# EAGLE design piezopiano (EAGLE 9.5.2)
CHECKED_BY: -; DRAWN_BY: Andreas Zapfl; REV: 1.1; TITLE: PiezoPiano
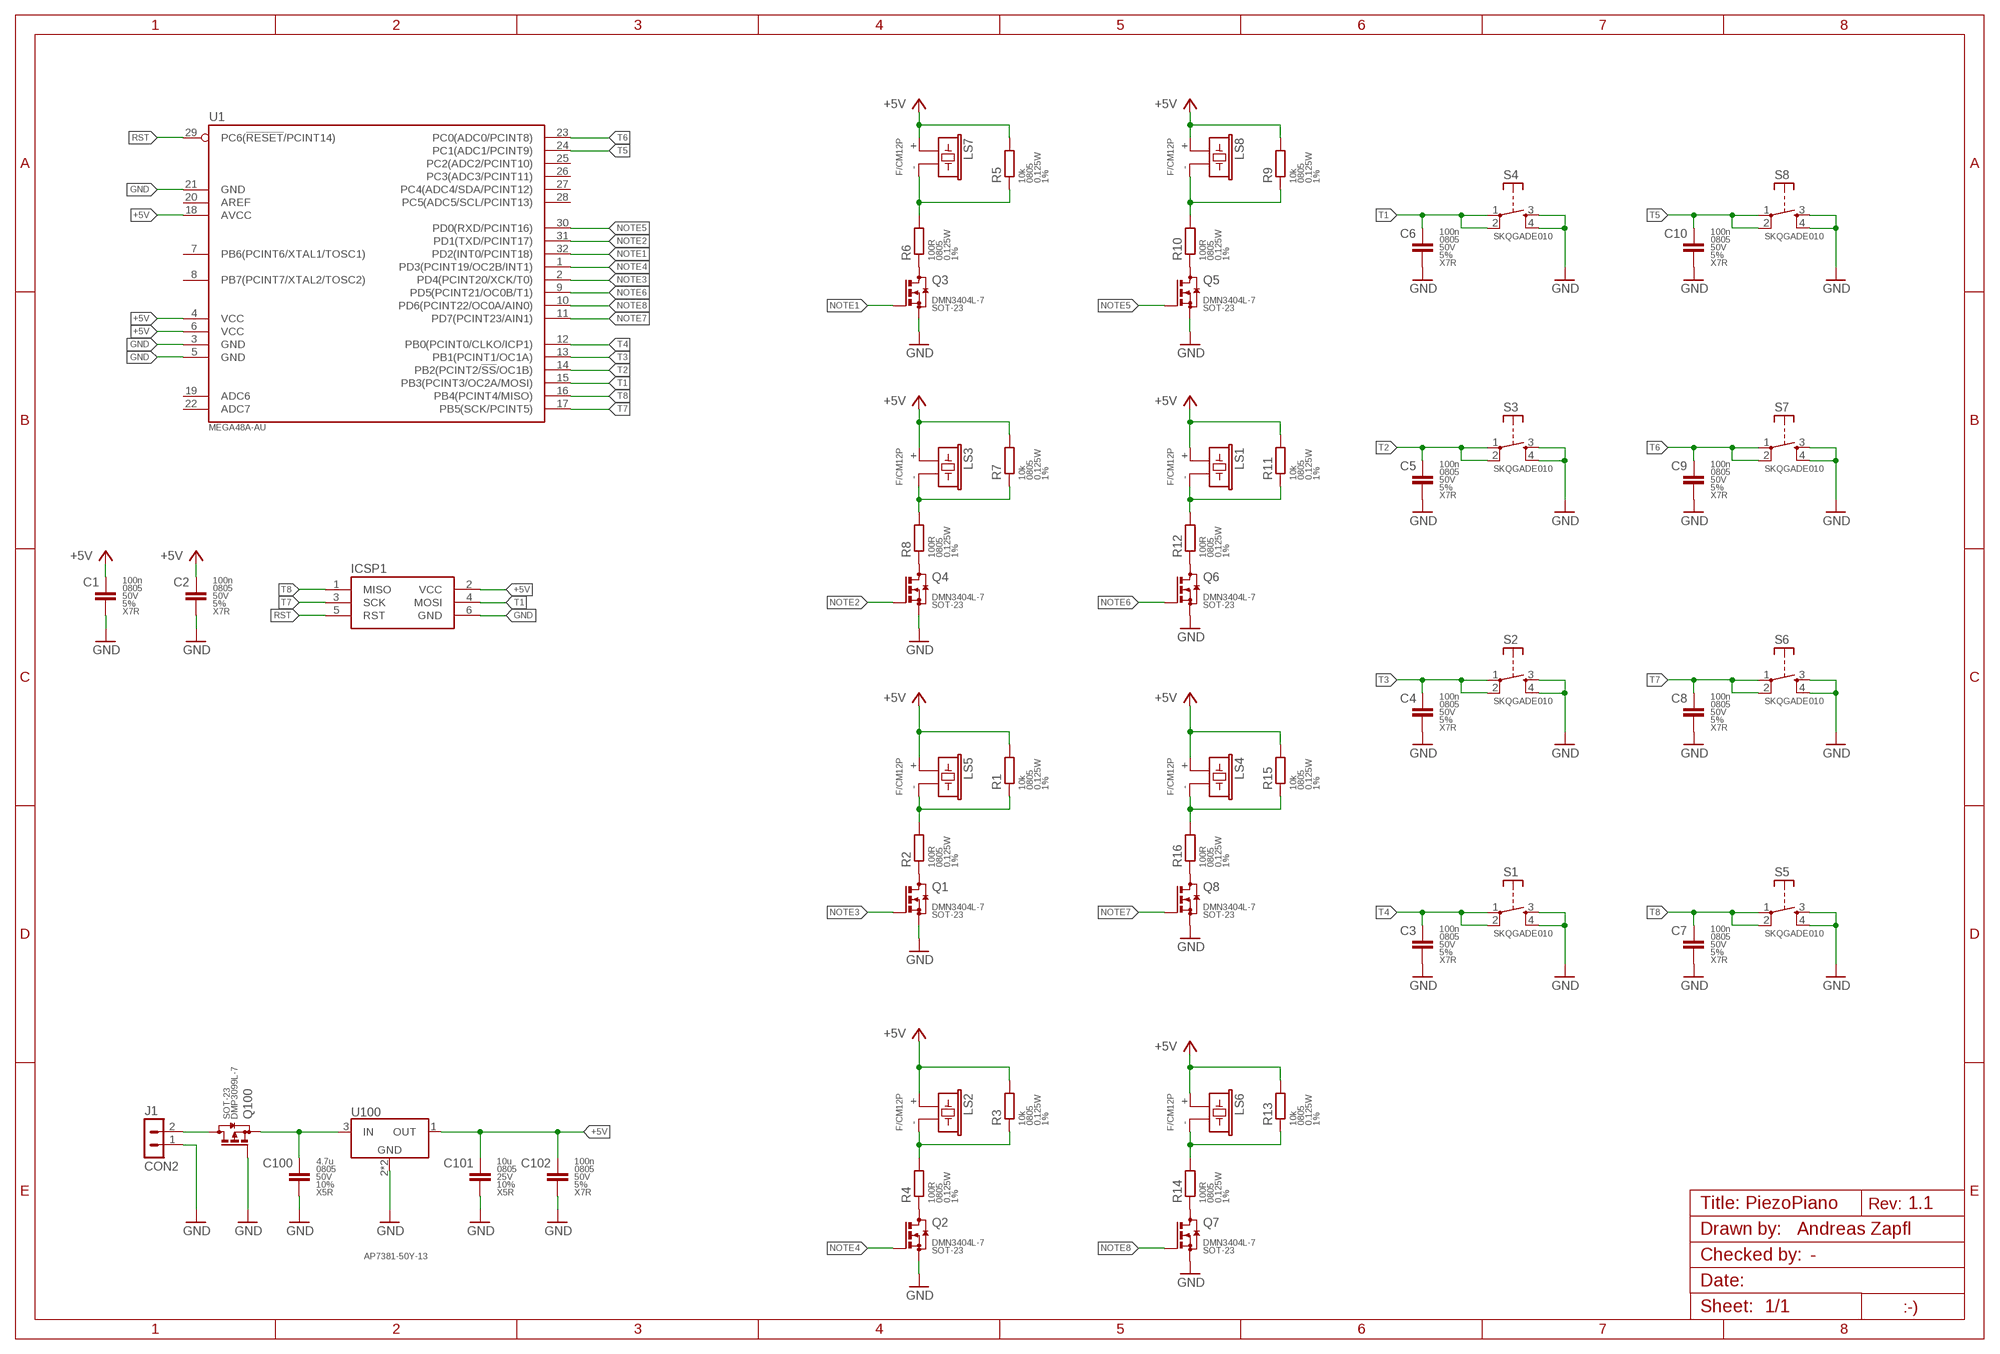
[diagram p0: schematic, sheet 1]

## Parts
C1  100n  100NF-0805-50V-5%  [C0805]
C2  100n  100NF-0805-50V-5%  [C0805]
C3  100n  100NF-0805-50V-5%  [C0805]
C4  100n  100NF-0805-50V-5%  [C0805]
C5  100n  100NF-0805-50V-5%  [C0805]
C6  100n  100NF-0805-50V-5%  [C0805]
C7  100n  100NF-0805-50V-5%  [C0805]
C8  100n  100NF-0805-50V-5%  [C0805]
C9  100n  100NF-0805-50V-5%  [C0805]
C10  100n  100NF-0805-50V-5%  [C0805]
C100  4.7u  4.7UF-0805-50V-10%  [C0805]
C101  10u  10UF-0805-25V-10%  [C0805]
C102  100n  100NF-0805-50V-5%  [C0805]
ICSP1  AVRISP2.54MM  [AVRISP-2.54]
J1  CON2  [H2-2.54]
LS1  F/CM12P  [CM12P/5.0P]
LS2  F/CM12P  [CM12P/5.0P]
LS3  F/CM12P  [CM12P/5.0P]
LS4  F/CM12P  [CM12P/5.0P]
LS5  F/CM12P  [CM12P/5.0P]
LS6  F/CM12P  [CM12P/5.0P]
LS7  F/CM12P  [CM12P/5.0P]
LS8  F/CM12P  [CM12P/5.0P]
Q1  DMN3404L  [SOT23]
Q2  DMN3404L  [SOT23]
Q3  DMN3404L  [SOT23]
Q4  DMN3404L  [SOT23]
Q5  DMN3404L  [SOT23]
Q6  DMN3404L  [SOT23]
Q7  DMN3404L  [SOT23]
Q8  DMN3404L  [SOT23]
Q100  DMP3099L  [SOT23]
R1  10k  10KOHM-0805-1/8W-1%  [R0805]
R2  100R  100OHM-0805-1/8W-1%  [R0805]
R3  10k  10KOHM-0805-1/8W-1%  [R0805]
R4  100R  100OHM-0805-1/8W-1%  [R0805]
R5  10k  10KOHM-0805-1/8W-1%  [R0805]
R6  100R  100OHM-0805-1/8W-1%  [R0805]
R7  10k  10KOHM-0805-1/8W-1%  [R0805]
R8  100R  100OHM-0805-1/8W-1%  [R0805]
R9  10k  10KOHM-0805-1/8W-1%  [R0805]
R10  100R  100OHM-0805-1/8W-1%  [R0805]
R11  10k  10KOHM-0805-1/8W-1%  [R0805]
R12  100R  100OHM-0805-1/8W-1%  [R0805]
R13  10k  10KOHM-0805-1/8W-1%  [R0805]
R14  100R  100OHM-0805-1/8W-1%  [R0805]
R15  10k  10KOHM-0805-1/8W-1%  [R0805]
R16  100R  100OHM-0805-1/8W-1%  [R0805]
S1  SKQGADE010  [TACTILE_SWITCH_SMD_5.2MM]
S2  SKQGADE010  [TACTILE_SWITCH_SMD_5.2MM]
S3  SKQGADE010  [TACTILE_SWITCH_SMD_5.2MM]
S4  SKQGADE010  [TACTILE_SWITCH_SMD_5.2MM]
S5  SKQGADE010  [TACTILE_SWITCH_SMD_5.2MM]
S6  SKQGADE010  [TACTILE_SWITCH_SMD_5.2MM]
S7  SKQGADE010  [TACTILE_SWITCH_SMD_5.2MM]
S8  SKQGADE010  [TACTILE_SWITCH_SMD_5.2MM]
U1  MEGA48A-AU  [TQFP32-08]
U100  AP7381-50Y-13  [SOT89]

## Nets
+5V: C1.1 C2.1 C101.1 C102.1 ICSP1.2(VCC) LS1.+ LS2.+ LS3.+ LS4.+ LS5.+ LS6.+ LS7.+ LS8.+ R1.2 R3.2 R5.2 R7.2 R9.2 R11.2 R13.2 R15.2 U1.4(VCC) U1.6(VCC) U1.18(AVCC) U100.1(OUT)
GND: C1.2 C2.2 C3.2 C4.2 C5.2 C6.2 C7.2 C8.2 C9.2 C10.2 C100.2 C101.2 C102.2 ICSP1.6(GND) J1.1 Q1.2(S) Q2.2(S) Q3.2(S) Q4.2(S) Q5.2(S) Q6.2(S) Q7.2(S) Q8.2(S) Q100.1(G) S1.3(S) S1.4(S) S2.3(S) S2.4(S) S3.3(S) S3.4(S) S4.3(S) S4.4(S) S5.3(S) S5.4(S) S6.3(S) S6.4(S) S7.3(S) S7.4(S) S8.3(S) S8.4(S) U1.3(GND) U1.5(GND) U1.21(GND) U100.2(GND) U100.2@1(GND)
N$1: J1.2 Q100.3(D)
N$2: Q4.3(D) R8.1
N$3: Q1.3(D) R2.1
N$4: LS2.- R3.1 R4.2
N$5: Q5.3(D) R10.1
N$6: LS1.- R11.1 R12.2
N$7: Q8.3(D) R16.1
N$8: Q7.3(D) R14.1
N$9: Q3.3(D) R6.1
N$10: LS3.- R7.1 R8.2
N$11: LS5.- R1.1 R2.2
N$12: Q2.3(D) R4.1
N$13: LS8.- R9.1 R10.2
N$14: Q6.3(D) R12.1
N$15: LS4.- R15.1 R16.2
N$16: LS6.- R13.1 R14.2
N$17: C100.1 Q100.2(S) U100.3(IN)
N$18: LS7.- R5.1 R6.2
NOTE1: Q3.1(G) U1.32(PD2(INT0/PCINT18))
NOTE2: Q4.1(G) U1.31(PD1(TXD/PCINT17))
NOTE3: Q1.1(G) U1.2(PD4(PCINT20/XCK/T0))
NOTE4: Q2.1(G) U1.1(PD3(PCINT19/OC2B/INT1))
NOTE5: Q5.1(G) U1.30(PD0(RXD/PCINT16))
NOTE6: Q6.1(G) U1.9(PD5(PCINT21/OC0B/T1))
NOTE7: Q8.1(G) U1.11(PD7(PCINT23/AIN1))
NOTE8: Q7.1(G) U1.10(PD6(PCINT22/OC0A/AIN0))
RST: ICSP1.5(RST) U1.29(PC6(!RESET!/PCINT14))
T1: C6.1 ICSP1.4(MOSI) S4.1(P) S4.2(P) U1.15(PB3(PCINT3/OC2A/MOSI))
T2: C5.1 S3.1(P) S3.2(P) U1.14(PB2(PCINT2/!SS!/OC1B))
T3: C4.1 S2.1(P) S2.2(P) U1.13(PB1(PCINT1/OC1A))
T4: C3.1 S1.1(P) S1.2(P) U1.12(PB0(PCINT0/CLKO/ICP1))
T5: C10.1 S8.1(P) S8.2(P) U1.24(PC1(ADC1/PCINT9))
T6: C9.1 S7.1(P) S7.2(P) U1.23(PC0(ADC0/PCINT8))
T7: C8.1 ICSP1.3(SCK) S6.1(P) S6.2(P) U1.17(PB5(SCK/PCINT5))
T8: C7.1 ICSP1.1(MISO) S5.1(P) S5.2(P) U1.16(PB4(PCINT4/MISO))
Unconnected: U1.7(PB6(PCINT6/XTAL1/TOSC1)) U1.8(PB7(PCINT7/XTAL2/TOSC2)) U1.19(ADC6) U1.20(AREF) U1.22(ADC7) U1.25(PC2(ADC2/PCINT10)) U1.26(PC3(ADC3/PCINT11)) U1.27(PC4(ADC4/SDA/PCINT12)) U1.28(PC5(ADC5/SCL/PCINT13))

## Library data of the parts
C1-C10 C102 = zaan-Capacitors:100NF: 100nF capacitor; DESCRIPTION: Surface Mount Capacitor; DIELECTRIC: X7R; MF: Yageo; MPN: CC0805JRX7R9BB104; PACKAGE: 2012; PACKAGE-IN: 0805; TOLERANCE: 5%; VOLTAGE: 50V
C100 = zaan-Capacitors:4.7UF: 4.7uF capacitor; DESCRIPTION: Surface Mount Capacitor; DIELECTRIC: X5R; MF: Murata; MPN: GRM21BR61H475KE51L; PACKAGE: 2012; PACKAGE-IN: 0805; TOLERANCE: 10%; VOLTAGE: 50V
C101 = zaan-Capacitors:10UF: 10uF capacitor; DESCRIPTION: Surface Mount Capacitor; DIELECTRIC: X5R; MF: Murata; MPN: GRJ21BR61E106KE01K; PACKAGE: 2012; PACKAGE-IN: 0805; TOLERANCE: 10%; VOLTAGE: 25V
ICSP1 = Custom:AVRISP
J1 = Custom:CON2
LS1-LS8 = zaan-Electromechanical:F/CM12P: BUZZER; DESCRIPTION: Piezo Buzzer; MF: ZLFY; MPN: ZL-YDW1207-4005PA-5.0
Q1-Q8 = zaan-Discrete:DMN3404L: N-CHANNEL MOS FET N-Channel Logic Level Enhancement Mode Field Effect Transistor Footprint: SOT-23 Source: Datasheet <https://www.diodes.com/assets/Datasheets/ds31787.pdf> Manufacturer: Diodes Incorporated; DESCRIPTION: N-CHANNEL MOSFET; MF: Diodes Incorporated; MPN: DMN3404L-7; PACKAGE: SOT-23
Q100 = zaan-Discrete:DMP3099L: P-CHANNEL MOS FET P-Channel Logic Level Enhancement Mode Field Effect Transistor Footprint: SOT-23 Source: Datasheet <https://www.diodes.com/assets/Datasheets/DMP3099L.pdf> Manufacturer: Diodes Incorporated; DESCRIPTION: P-CHANNEL MOSFET; MF: Diodes Incorporated; MPN: DMP3099L-7; PACKAGE: SOT-23
R1 R3 R5 R7 R9 R11 R13 R15 = zaan-Resistors:10KOHM: 10kΩ resistor; DESCRIPTION: Surface Mount Resistor; MF: Yageo; MPN: RC0805FR-0710KL; PACKAGE: 2012; PACKAGE-IN: 0805; POWER: 0.125W; TOLERANCE: 1%; VOLTAGE: 150V
R2 R4 R6 R8 R10 R12 R14 R16 = zaan-Resistors:100OHM: 100Ω resistor; DESCRIPTION: Surface Mount Resistor; MF: Yageo; MPN: RC0805FR-07100RL; PACKAGE: 2012; PACKAGE-IN: 0805; POWER: 0.125W; TOLERANCE: 1%; VOLTAGE: 150V
S1-S8 = zaan-Electromechanical:SKQGADE010
U1 = zaan-IC-Microcontroller:MEGA48: 8-Bit Microcontroller megaAVR® low power, CMOS 8-bit microcontroller Footprint: TQFP-32 Source: Datasheet <http://ww1.microchip.com/downloads/en/DeviceDoc/ATmega48A-PA-88A-PA-168A-PA-328-P-DS-DS40002061A.pdf> Manufacturer: Atmel; DESCRIPTION: 8-Bit Microcontroller; MF: Atmel; MPN: ATmega48A-AU; PACKAGE: TQFP-32
U100 = zaan-IC-Power:AP7381: Low Dropout Regulator WIDE INPUT VOLTAGE RANGE, 150mA ULDO REGULATOR Footprint: SOT-89 Source: Datasheet <https://www.diodes.com/assets/Datasheets/AP7381.pdf> Manufacturer: Diodes Incorporated; DESCRIPTION: Low Dropout Regulator; MF: Diodes Incorporated; MPN: AP7381-50Y-13; PACKAGE: SOT-89

## Net classes
0 default: width 0.254 mm

## Board
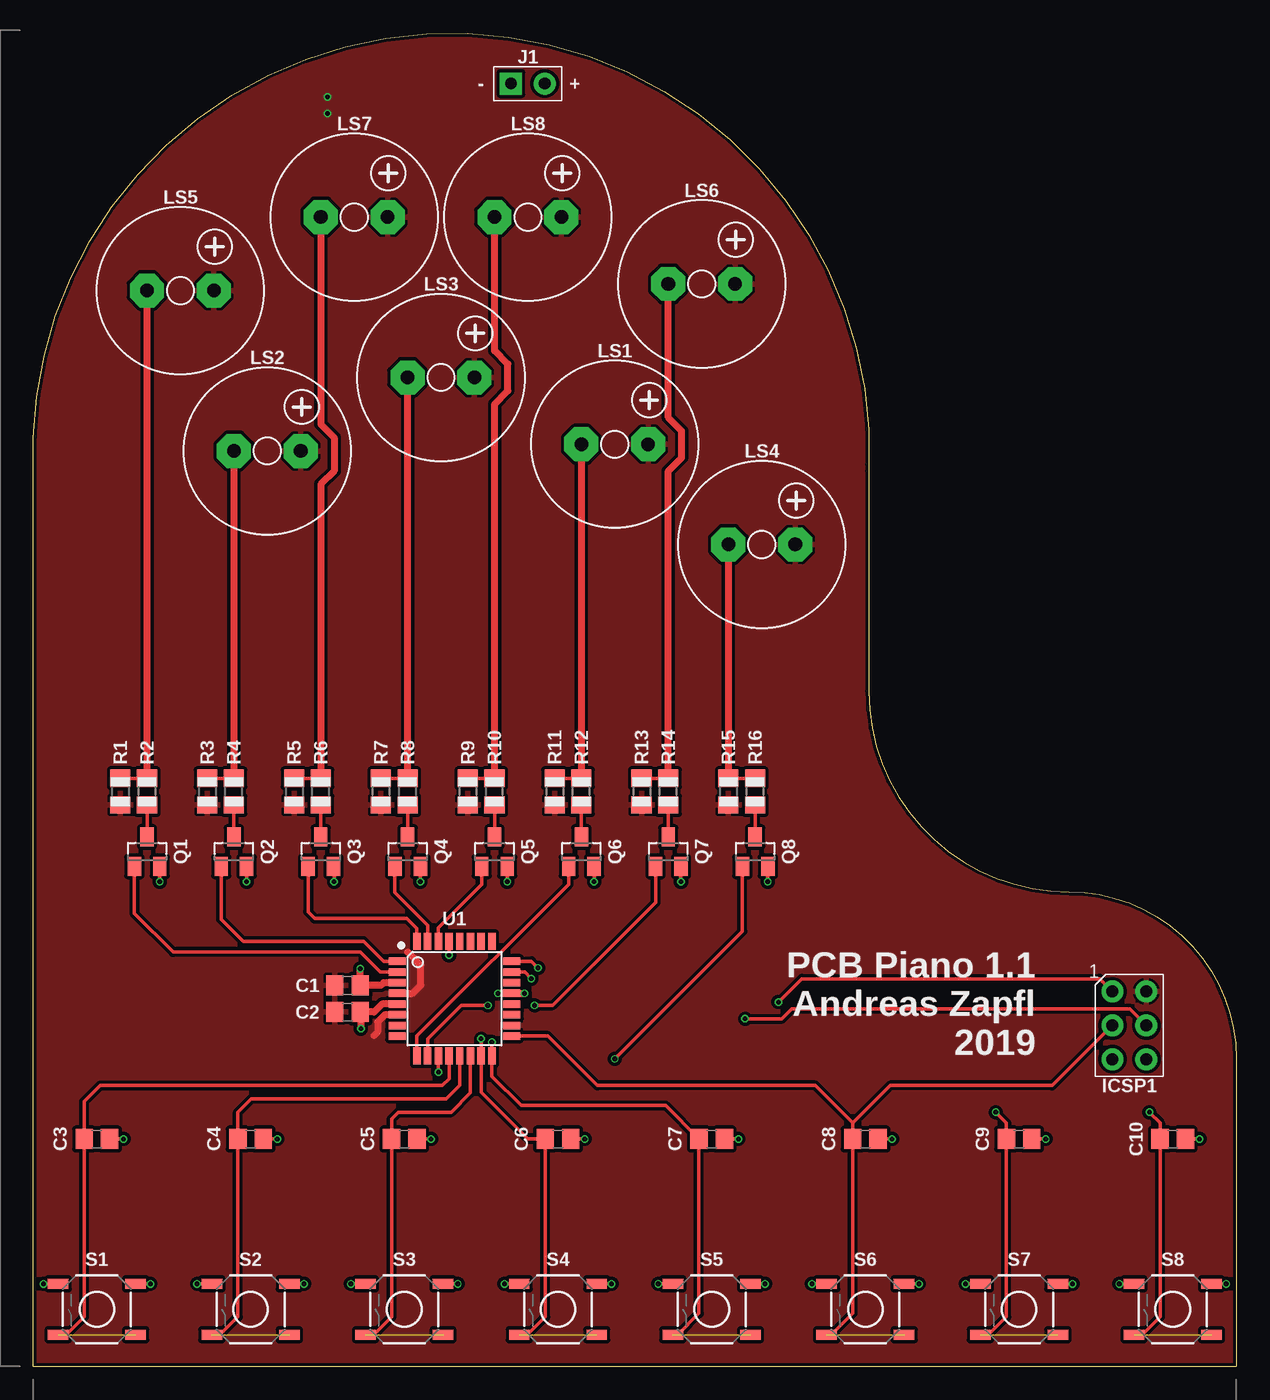
[diagram p1: board, top side]
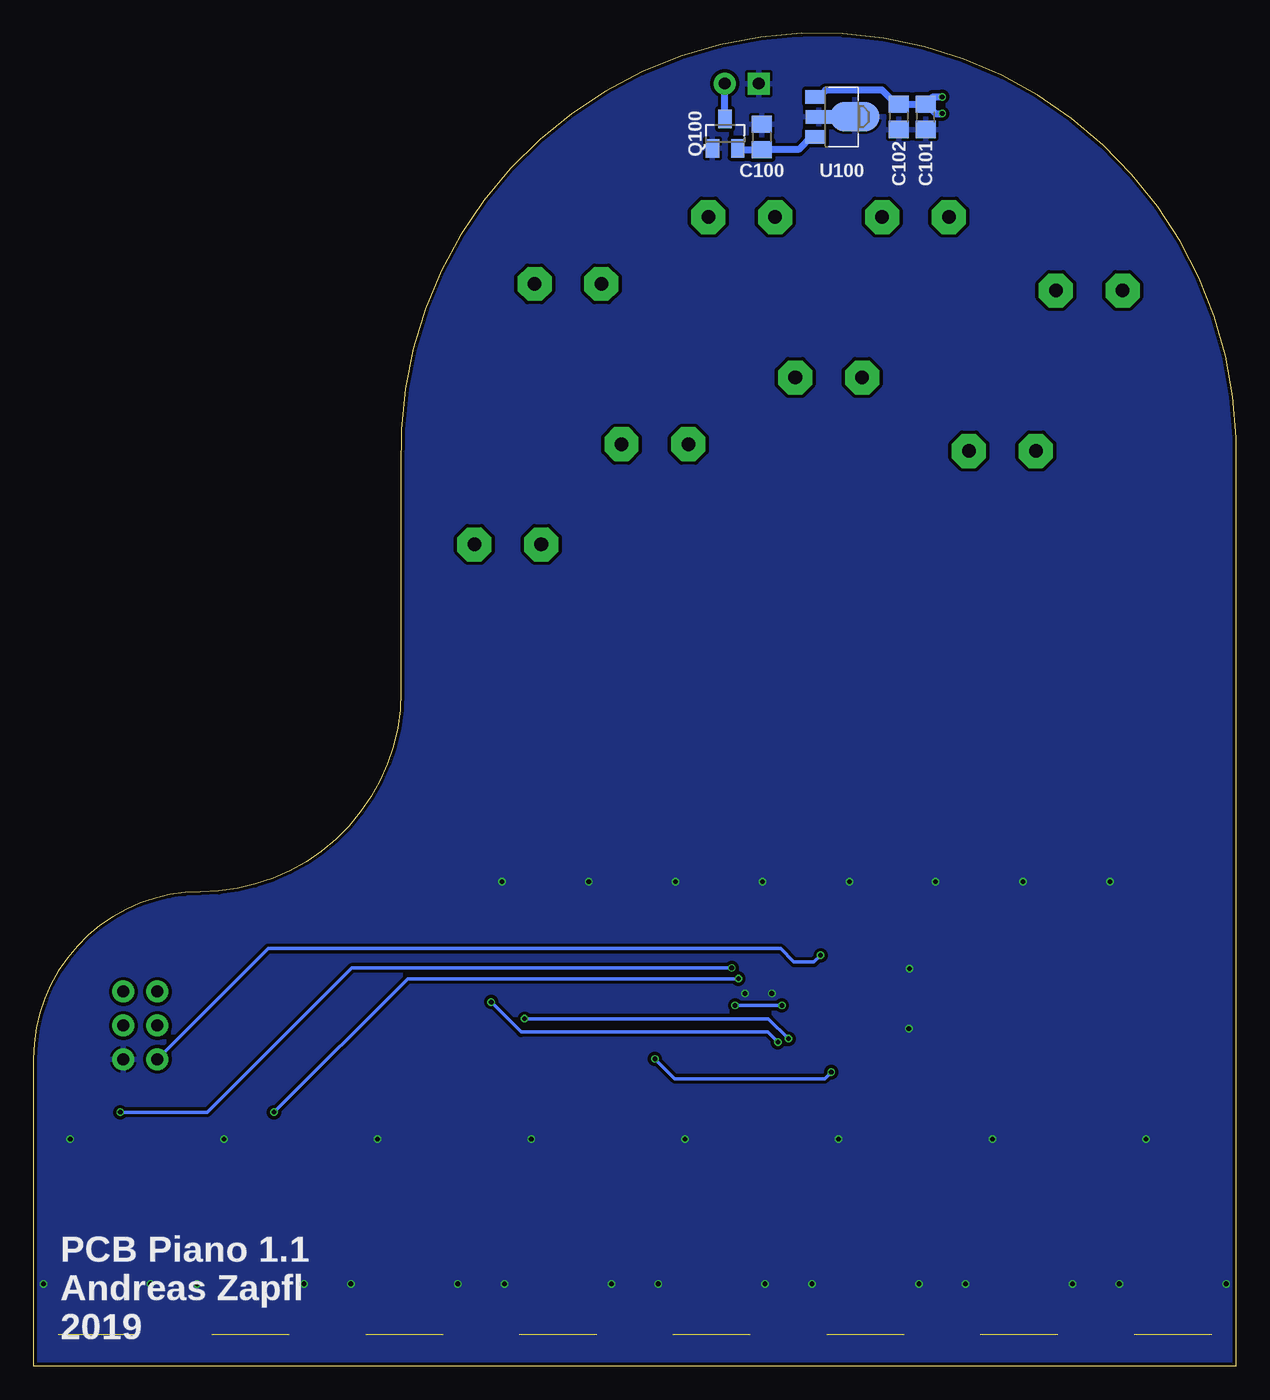
[diagram p2: board, bottom side, seen from below]

Size 90 x 99.75 mm. Coordinates in mm from the lower left corner, seen from the top.
Outline: 62.5,67.5 62.5,67
Outline: 62.5,67 62.5,50.5 arc90 77.5,35.5 arc-90 90,23 90,0 0,0 0,69.5 arc-181 62.5,67
Copper layers (1*16): Top 0.035mm / dielectric 1.55mm / Bottom 0.035mm
Design rules "Multi-CB_2L *": minimum track width 0.1mm, minimum drill 0.2mm, track to track 0.1mm, track to pad 0.1mm, pad to pad 0.1mm, via to via 0.1mm, smd to smd 0mil, copper to edge 0.2mm, drill to drill 0.2mm, minimum pad ring 0.125mm, minimum via ring 0.1mm, stop-mask expansion 2mil, vias tented up to drill 0.45mm, thermal gap 0.2mm

### Footprints (pad centres in the part's own frame; a part is rotated, then mirrored left to right if it is on the bottom)
C0805 = smd 1.3 x 1.5: 1 -0.95,0; 2 0.95,0
AVRISP-2.54 = drill 0.9 pad 1.626: 1 -1.27,2.54; 2 1.27,2.54; 3 -1.27,0; 4 1.27,0; 5 -1.27,-2.54; 6 1.27,-2.54
H2-2.54 = drill 0.889 pad 1.651 square: 1 0,1.27 | drill 0.889 pad 1.651: 2 0,-1.27
CM12P/5.0P = drill 1.016 pad 2.54 octagon: + 2.5,0; - -2.5,0
SOT23 = smd 1 x 1.4: 1 -0.95,-1.1; 2 0.95,-1.1; 3 0,1.1
R0805 = smd 1.3 x 1.5: 1 -1,0; 2 1,0
TACTILE_SWITCH_SMD_5.2MM = smd 1.524 x 0.762: 1 -2.9,1.905; 2 2.9,1.905; 3 -2.9,-1.905; 4 2.9,-1.905
TQFP32-08 = smd 1.27 x 0.559: 1 -4.293,2.8; 2 -4.293,2; 3 -4.293,1.2; 4 -4.293,0.4; 5 -4.293,-0.4; 6 -4.293,-1.2; 7 -4.293,-2; 8 -4.293,-2.8; 17 4.293,-2.8; 18 4.293,-2; 19 4.293,-1.2; 20 4.293,-0.4; 21 4.293,0.4; 22 4.293,1.2; 23 4.293,2; 24 4.293,2.8 | smd 0.559 x 1.27: 9 -2.8,-4.293; 10 -2,-4.293; 11 -1.2,-4.293; 12 -0.4,-4.293; 13 0.4,-4.293; 14 1.2,-4.293; 15 2,-4.293; 16 2.8,-4.293; 25 2.8,4.293; 26 2,4.293; 27 1.2,4.293; 28 0.4,4.293; 29 -0.4,4.293; 30 -1.2,4.293; 31 -2,4.293; 32 -2.8,4.293
SOT89 = smd 1 x 1.5: 1 -1.499,-1.981; 3 1.499,-1.981 | smd 1 x 2: 2 0,-1.727 | smd 2.2 x 3.7: 2@1 0,0.94

### Placement (x,y rotation side)
C1  23.5,28.5 0 top
C2  23.5,26.5 0 top
C3  4.75,17 0 top
C4  16.25,17 0 top
C5  27.75,17 0 top
C6  39.25,17 0 top
C7  50.75,17 0 top
C8  62.25,17 0 top
C9  73.75,17 0 top
C10  85.25,17 0 top
C100  35.5,92 90 bottom
C101  23.25,93.5 270 bottom
C102  25.25,93.5 270 bottom
ICSP1  82,25.5 0 top
J1  37,96 90 top
LS1  43.5,69 0 top
LS2  17.5,68.5 0 top
LS3  30.5,74 0 top
LS4  54.5,61.5 0 top
LS5  11,80.5 0 top
LS6  50,81 0 top
LS7  24,86 0 top
LS8  37,86 0 top
Q1  8.5,38.5 0 top
Q2  15,38.5 0 top
Q3  21.5,38.5 0 top
Q4  28,38.5 0 top
Q5  34.5,38.5 0 top
Q6  41,38.5 0 top
Q7  47.5,38.5 0 top
Q8  54,38.5 0 top
Q100  38.25,92.25 0 bottom
R1  6.5,43 270 top
R2  8.5,43 90 top
R3  13,43 270 top
R4  15,43 90 top
R5  19.5,43 270 top
R6  21.5,43 90 top
R7  26,43 270 top
R8  28,43 90 top
R9  32.5,43 270 top
R10  34.5,43 90 top
R11  39,43 270 top
R12  41,43 90 top
R13  45.5,43 270 top
R14  47.5,43 90 top
R15  52,43 270 top
R16  54,43 90 top
S1  4.75,4.25 180 top
S2  16.25,4.25 180 top
S3  27.75,4.25 180 top
S4  39.25,4.25 180 top
S5  50.75,4.25 180 top
S6  62.25,4.25 180 top
S7  73.75,4.25 180 top
S8  85.25,4.25 180 top
U1  31.5,27.5 0 top
U100  29.5,93.5 270 bottom

### Tracks (layer width: path | path; a pad name or v marks a point on that pad's centre or on a via)
+5V  (via drill 0.35)
  Top 0.508: U1.6 26.3,26.3 25.75,25.75 25.75,25 25.5,24.75 | U1.4 28.4,27.9 29,28.5 29,30 28,31
  Bottom 0.508: C101.1 22.7,95 v22,95 | C101.1 23.23,94.47 22.5,93.75 v22,93.75 | C101.1 C102.1 25.45,94.45 26.5,95.5 30.73,95.5 31.23,95 U100.1
  pour Top (isolate 0.254): 0,0 0,100 90,100 90,0
GND  (via drill 0.35)
  Top 0.254: Q3.2 22.5,37.4 v22.5,36.25 | Q4.2 v28.95,36.25 | Q6.2 v41.95,36.25 | Q5.2 v35.45,36.25 | Q2.2 v15.95,36.25 | Q1.2 v9.45,36.25 | Q8.2 v54.95,36.25 | Q7.2 v48.45,36.25 | S1.4 v0.75,6.16 | v8.75,6.16 S1.3 | S2.4 v12.25,6.16 | S2.3 v20.25,6.16 | S3.4 v23.75,6.16 | S3.3 v31.75,6.16 | S4.4 v35.25,6.16 | S4.3 v43.25,6.16 | S5.4 v46.75,6.16 | S5.3 v54.75,6.16 | S6.4 v58.25,6.16 | S6.3 v66.25,6.16 | S7.4 v69.75,6.16 | S7.3 v77.75,6.16 | S8.4 v81.25,6.16 | S8.3 v89.25,6.16 | v6.75,17 C3.2 | v18.25,17 C4.2 | v29.75,17 C5.2 | v41.25,17 C6.2 | C7.2 v52.75,17 | v64.25,17 C8.2 | v75.75,17 C9.2 | v87.25,17 C10.2
  Top 0.508: v36.75,27.9 U1.21 v34.75,27.9 | U1.3 26.2,28.7 26,28.5 C1.2 v24.45,29.75 | U1.5 26.1,27.1 25.5,26.5 C2.2 24.5,26.45 v24.5,25.25
  pour Bottom (isolate 0.254): 0,0 0,100 90,100 90,0
N$1
  Bottom 0.508: Q100.3 38.27,93.37 J1.2
N$2
  Top 0.254: Q4.3 R8.1
N$3
  Top 0.254: Q1.3 R2.1
N$4
  Top 0.254: R3.1 R4.2
  Top 0.508: LS2.- R4.2
N$5
  Top 0.254: Q5.3 R10.1
N$6
  Top 0.254: R11.1 R12.2
  Top 0.508: LS1.- R12.2
N$7
  Top 0.254: Q8.3 R16.1
N$8
  Top 0.254: Q7.3 R14.1
N$9
  Top 0.254: Q3.3 R6.1
N$10
  Top 0.254: R7.1 R8.2
  Top 0.508: R8.2 LS3.-
N$11
  Top 0.254: R1.1 R2.2
  Top 0.508: R2.2 LS5.-
N$12
  Top 0.254: Q2.3 R4.1
N$13
  Top 0.254: R9.1 R10.2
  Top 0.508: R10.2 34.5,72 35.5,73 35.5,75 34.5,76 LS8.-
N$14
  Top 0.254: Q6.3 R12.1
N$15
  Top 0.254: R15.1 R16.2
  Top 0.508: LS4.- R15.1
N$16
  Top 0.254: R13.1 R14.2
  Top 0.508: R14.2 47.5,67 48.5,68 48.5,70 47.5,71 LS6.-
N$17
  Bottom 0.508: Q100.2 37.2,91.05 C100.1 32.74,91.05 31.79,92 U100.3
N$18
  Top 0.254: R5.1 R6.2
  Top 0.508: LS7.- 21.5,70.5 22.5,69.5 22.5,67 21.5,66 R6.2
NOTE1
  Top 0.254: U1.32 28.7,32.75 27.95,33.5 21.05,33.5 20.55,34 Q3.1
NOTE2
  Top 0.254: Q4.1 27.05,35.45 28.34,34.16 29.5,33 U1.31
NOTE3
  Top 0.254: Q1.1 7.55,33.9 10.45,31 24.46,31 25.96,29.5 U1.2
NOTE4
  Top 0.254: U1.1 26.21,30.3 24.71,31.8 15.7,31.8 14.05,33.45 Q2.1
NOTE5
  Top 0.254: Q5.1 33.55,36.05 30.3,32.8 U1.30
NOTE6
  Top 0.254: U1.9 28.7,24.71 40.05,36.06 Q6.1
NOTE7  (via drill 0.35)
  Top 0.254: U1.11 v30.3,22 | v43.5,23 53.05,32.55 Q8.1
  Bottom 0.254: v30.3,22 30.8,21.5 42,21.5 v43.5,23
NOTE8  (via drill 0.35)
  Top 0.254: v37.5,27 38.85,27 46.55,34.7 Q7.1 | v34,27 32,27 29.5,24.5 U1.10
  Bottom 0.254: v37.5,27 v34,27
RST  (via drill 0.35)
  Top 0.254: U1.29 v31.1,30.75
  Bottom 0.254: ICSP1.5 72.44,31.25 34.1,31.25 33.1,30.25 31.6,30.25 v31.1,30.75
T1  (via drill 0.35)  (1 unrouted)
  Top 0.254: S4.2 36.96,2.35 38.3,3.69 C6.1 37,17 33.5,20.5 U1.15 v33.5,24.5 | v53.25,26 56,26 56.75,26.75 82.02,26.75 ICSP1.4
  Bottom 0.254: v33.5,24.5 35,26 v53.25,26
T2  (1 unrouted)
  Top 0.254: S3.2 25.46,2.35 26.8,3.69 C5.1 26.8,18.5 27.3,19 31.25,19 32.7,20.45 U1.14
T3  (1 unrouted)
  Top 0.254: S2.2 13.96,2.35 15.3,3.69 C4.1 15.3,19 16.3,20 30.9,20 31.9,21 U1.13
T4  (1 unrouted)
  Top 0.254: S1.2 2.46,2.35 3.8,3.69 C3.1 3.8,19.8 5,21 30.6,21 31.1,21.5 U1.12
T5  (via drill 0.35)  (1 unrouted)
  Top 0.254: S8.2 82.96,2.35 84.3,3.69 C10.1 84.3,18.2 v83.5,19 | v37.75,29.8 37.25,30.3 U1.24
  Bottom 0.254: v83.5,19 77,19 66.2,29.8 v37.75,29.8
T6  (via drill 0.35)  (1 unrouted)
  Top 0.254: S7.2 71.46,2.35 72.8,3.69 C9.1 72.8,18.2 v72,19 | v37.25,29 36.75,29.5 U1.23
  Bottom 0.254: v72,19 62,29 v37.25,29
T7  (1 unrouted)
  Top 0.254: S6.2 59.71,2.35 61.3,3.94 C8.1 61.3,18.2 | U1.17 38.49,24.7 42.19,21 58.5,21 61.3,18.2 | 61.3,18.2 64.1,21 76.23,21 ICSP1.3
T8  (via drill 0.35)  (1 unrouted)
  Top 0.254: S5.2 48.21,2.35 49.8,3.94 C7.1 47.3,19.5 36.5,19.5 34.3,21.7 U1.16 v34.3,24.25 | v55.75,27.25 57.5,29 79.77,29 ICSP1.1
  Bottom 0.254: v34.3,24.25 35.05,25 53.5,25 v55.75,27.25

### Text on the board
tPlace: - | +
tNames: PCB Piano 1.1 / Andreas Zapfl / 2019
bNames: PCB Piano 1.1 / Andreas Zapfl / 2019